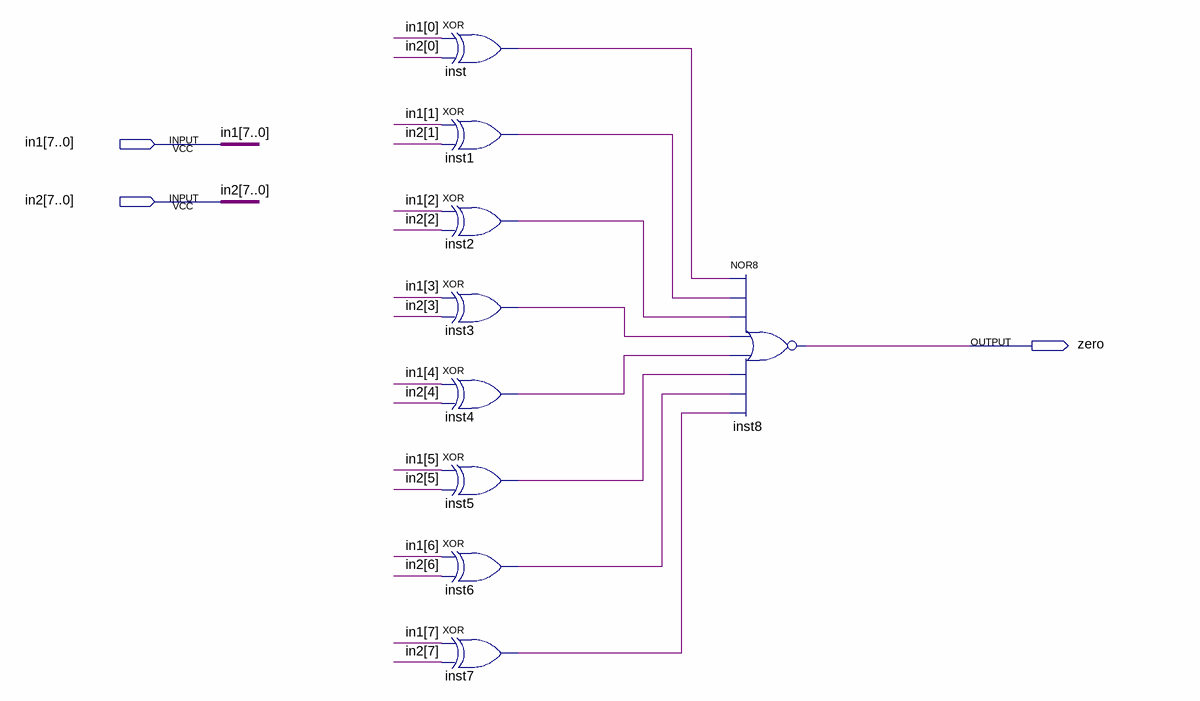
[diagram p0: schematic sheet]
// Quartus schematic EQU.bdf as structural Verilog: 9 symbols, 3 pins
module EQU (
  input  [7:0] in1,
  input  [7:0] in2,
  output zero
);

  wire inst1_out, inst2_out, inst3_out, inst4_out, inst5_out, inst6_out, inst7_out, inst_out;

  xor inst (inst_out, in1[0], in2[0]);
  xor inst1 (inst1_out, in1[1], in2[1]);
  xor inst2 (inst2_out, in1[2], in2[2]);
  xor inst3 (inst3_out, in1[3], in2[3]);
  xor inst4 (inst4_out, in1[4], in2[4]);
  xor inst5 (inst5_out, in1[5], in2[5]);
  xor inst6 (inst6_out, in1[6], in2[6]);
  xor inst7 (inst7_out, in1[7], in2[7]);
  nor inst8 (zero, inst_out, inst1_out, inst2_out, inst3_out, inst4_out, inst5_out, inst6_out, inst7_out);
endmodule
